# Altium schematic sheet Shift_Regs.SchDoc
size A3
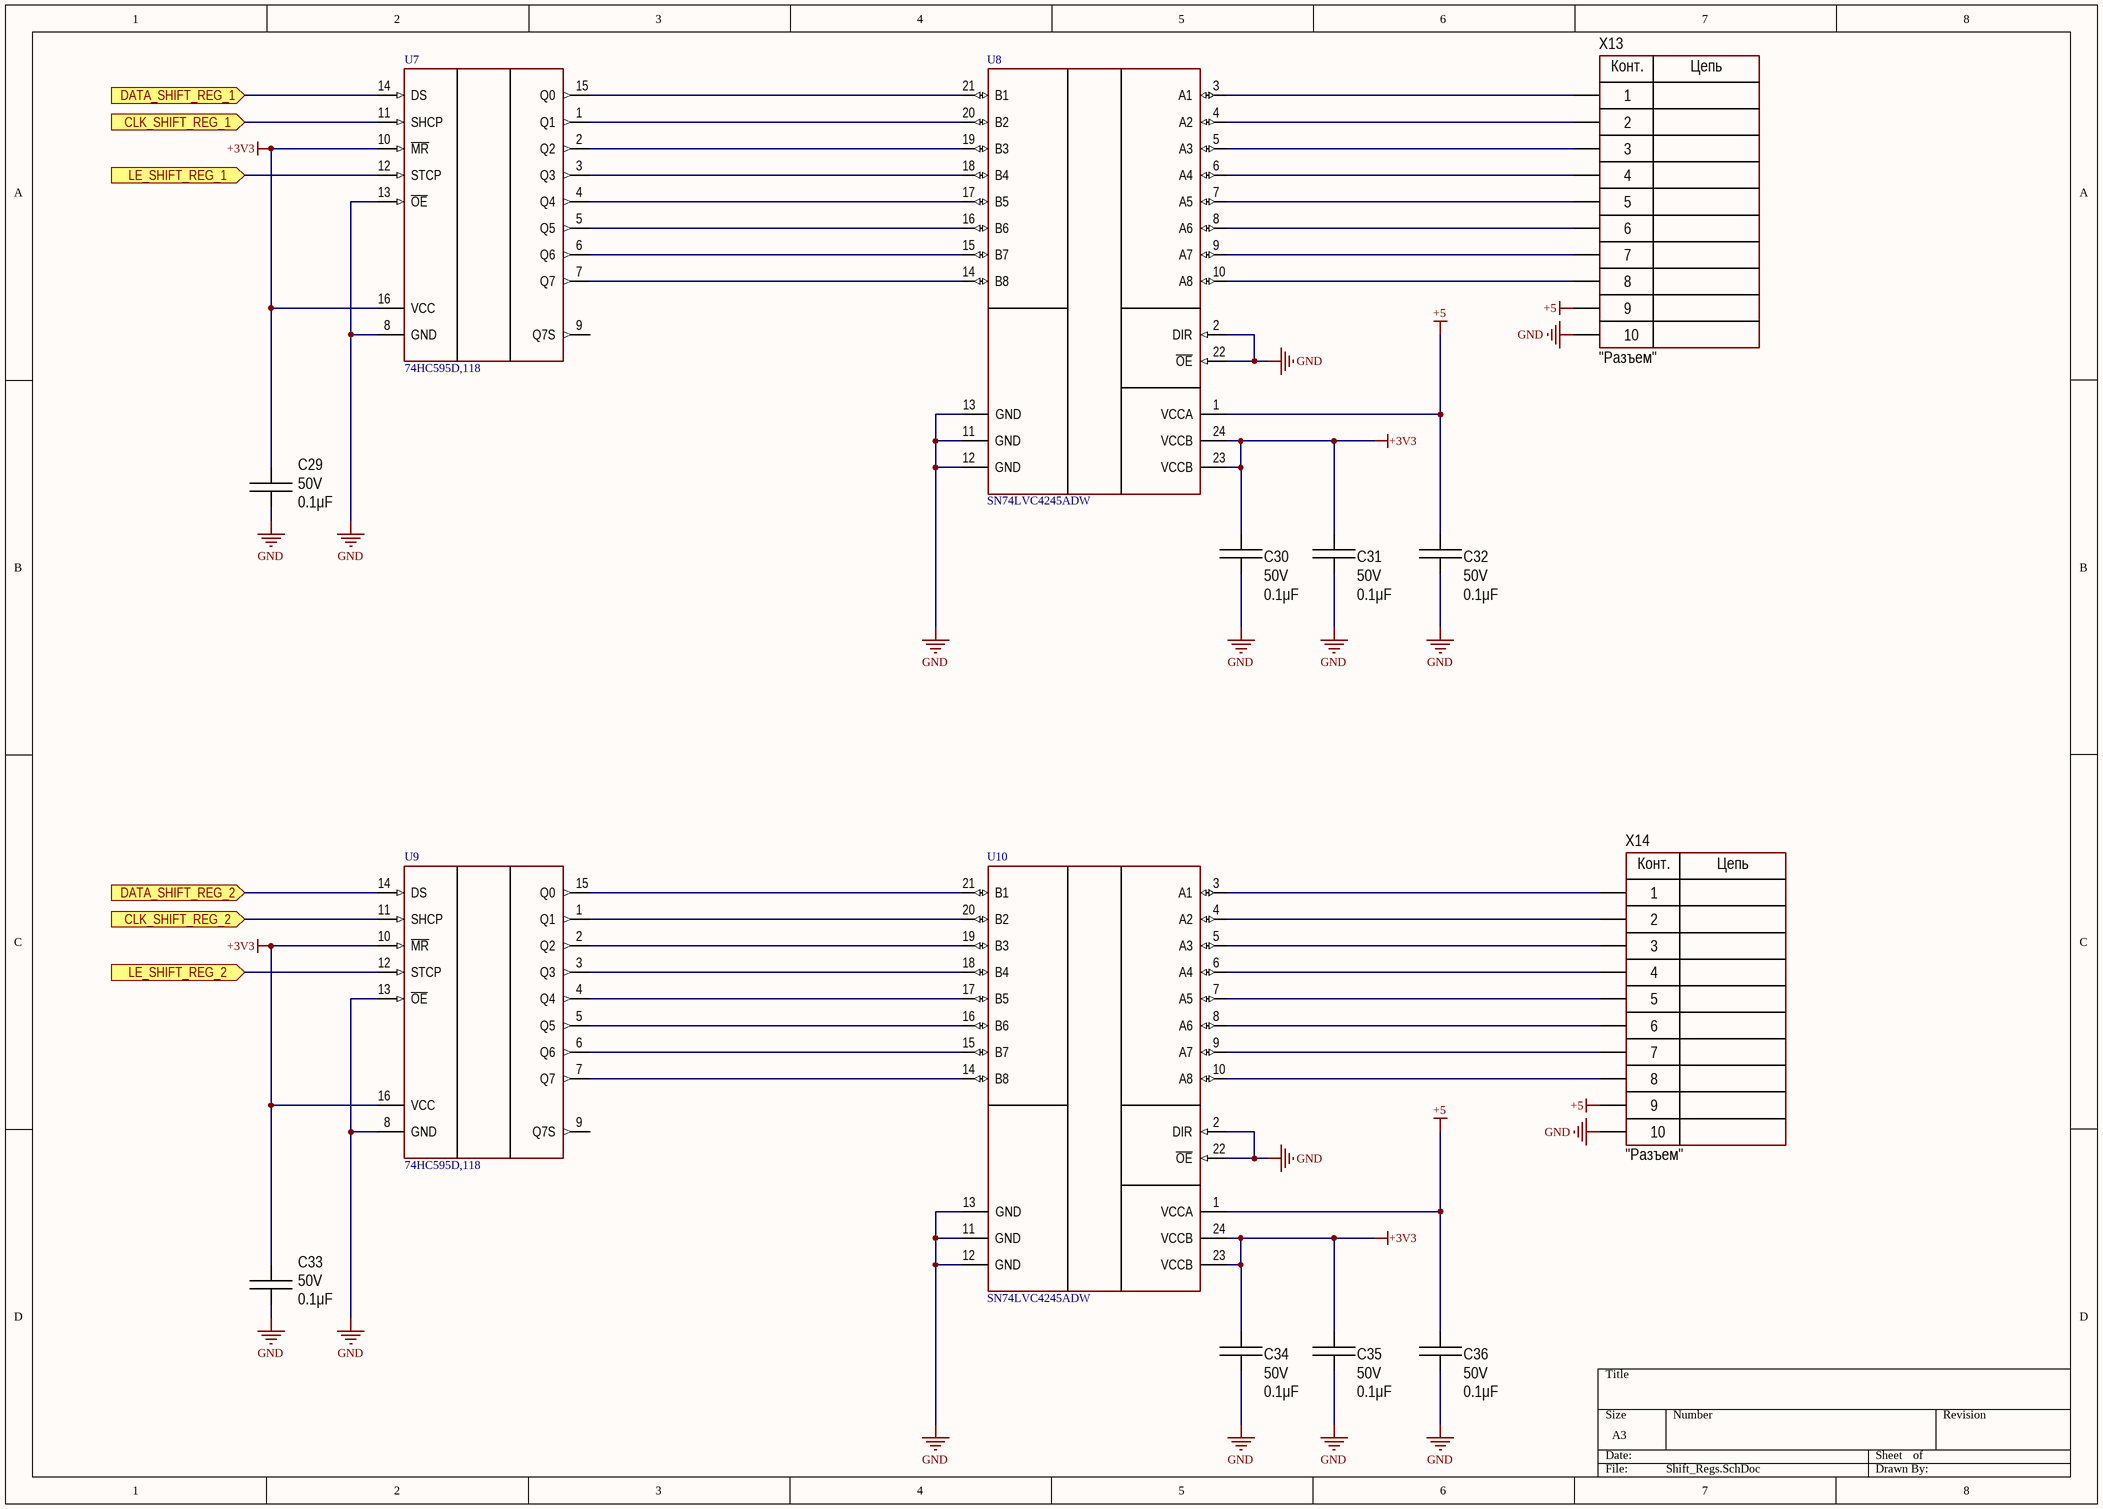
[diagram p0: Shift_Regs.SchDoc]

## Parts
C29  value 0.1μF  Voltage: 50V  [CAP: 1206]
C30  value 0.1μF  Voltage: 50V  [CAP: 1206]
C31  value 0.1μF  Voltage: 50V  [CAP: 1206]
C32  value 0.1μF  Voltage: 50V  [CAP: 1206]
C33  value 0.1μF  Voltage: 50V  [CAP: 1206]
C34  value 0.1μF  Voltage: 50V  [CAP: 1206]
C35  value 0.1μF  Voltage: 50V  [CAP: 1206]
C36  value 0.1μF  Voltage: 50V  [CAP: 1206]
U7  74HC595D,118  [FP-SOT109-1-MFG]
U8  SN74LVC4245ADW  [FP-DW0024A-MFG]
U9  74HC595D,118  [FP-SOT109-1-MFG]
U10  SN74LVC4245ADW  [FP-DW0024A-MFG]
X13  CommentText: "Разъем"  [CON: IDC-10MS]
X14  CommentText: "Разъем"  [CON: IDC-10MS]

## Ports
CLK_SHIFT_REG_1 (in), CLK_SHIFT_REG_2 (in), DATA_SHIFT_REG_1 (in), DATA_SHIFT_REG_2 (in), LE_SHIFT_REG_1 (in), LE_SHIFT_REG_2 (in)

## Nets
+3V3: C29.2 C30.2 C31.2 C33.2 C34.2 C35.2 U7.10(~{MR}) U7.16(VCC) U8.23(VCCB) U8.24(VCCB) U9.10(~{MR}) U9.16(VCC) U10.23(VCCB) U10.24(VCCB)
+5: C32.2 C36.2 U8.1(VCCA) U10.1(VCCA) X13.9 X14.9
GND: C29.1 C30.1 C31.1 C32.1 C33.1 C34.1 C35.1 C36.1 U7.8(GND) U7.13(~{OE}) U8.2(DIR) U8.11(GND) U8.12(GND) U8.13(GND) U8.22(~{OE}) U9.8(GND) U9.13(~{OE}) U10.2(DIR) U10.11(GND) U10.12(GND) U10.13(GND) U10.22(~{OE}) X13.10 X14.10
CLK_SHIFT_REG_1: U7.11(SHCP) ; port CLK_SHIFT_REG_1
CLK_SHIFT_REG_2: U9.11(SHCP) ; port CLK_SHIFT_REG_2
DATA_SHIFT_REG_1: U7.14(DS) ; port DATA_SHIFT_REG_1
DATA_SHIFT_REG_2: U9.14(DS) ; port DATA_SHIFT_REG_2
LE_SHIFT_REG_1: U7.12(STCP) ; port LE_SHIFT_REG_1
LE_SHIFT_REG_2: U9.12(STCP) ; port LE_SHIFT_REG_2
NetU7_1: U7.1(Q1) U8.20(B2)
NetU7_2: U7.2(Q2) U8.19(B3)
NetU7_3: U7.3(Q3) U8.18(B4)
NetU7_4: U7.4(Q4) U8.17(B5)
NetU7_5: U7.5(Q5) U8.16(B6)
NetU7_6: U7.6(Q6) U8.15(B7)
NetU7_7: U7.7(Q7) U8.14(B8)
NetU7_15: U7.15(Q0) U8.21(B1)
NetU8_3: U8.3(A1) X13.1
NetU8_4: U8.4(A2) X13.2
NetU8_5: U8.5(A3) X13.3
NetU8_6: U8.6(A4) X13.4
NetU8_7: U8.7(A5) X13.5
NetU8_8: U8.8(A6) X13.6
NetU8_9: U8.9(A7) X13.7
NetU8_10: U8.10(A8) X13.8
NetU9_1: U9.1(Q1) U10.20(B2)
NetU9_2: U9.2(Q2) U10.19(B3)
NetU9_3: U9.3(Q3) U10.18(B4)
NetU9_4: U9.4(Q4) U10.17(B5)
NetU9_5: U9.5(Q5) U10.16(B6)
NetU9_6: U9.6(Q6) U10.15(B7)
NetU9_7: U9.7(Q7) U10.14(B8)
NetU9_15: U9.15(Q0) U10.21(B1)
NetU10_3: U10.3(A1) X14.1
NetU10_4: U10.4(A2) X14.2
NetU10_5: U10.5(A3) X14.3
NetU10_6: U10.6(A4) X14.4
NetU10_7: U10.7(A5) X14.5
NetU10_8: U10.8(A6) X14.6
NetU10_9: U10.9(A7) X14.7
NetU10_10: U10.10(A8) X14.8

Not connected (* = marked no-connect by the designer): U7 9(Q7S); U9 9(Q7S)

## Notes on the sheet
- (in symbol IDC-10) Конт.; Цепь

## Library data of the parts
C29-C36 = Ceramic_1206: Manufacturer: Yageo; PartNumber: CC1206KRX7R9BB104; ValueManufacturerPartNumber: Ceramic capacitor, 0.1μF, X7R, ±10%, 50V, 1206, -55...+125°C; TypeCapacitor: Ceramic capacitor; Tolerance: ±10%; TypeDielectric: X7R; Package: 1206; HelpURL: https://www.digikey.com/product-detail/en/yageo/CC1206KRX7R9BB104/311-1179-1-ND/303089; Temperature: -55...+125°C
U7 U9 = CMP-14351-000006-1: IC SHIFT REGISTER 8BIT 16SOIC; RoHS Compliant: Yes
U8 U10 = CMP-04899-000091-1: IC TRNSLTR BIDIRECTIONAL 24SOIC; Number of Bits: 8; Low Level Output Current: 24mA; Output Type: Voltage; Propagation Delay: 9.8ns; Min Supply Voltage: 4.5V; Number of Elements: 1; Turn-On Delay Time: 6.7ns; Max Supply Current: 80uA; Max Supply Voltage: 5.5V; Polarity: Non-Inverting; Logic Function: Translator; Operating Supply Voltage: 5V; High Level Output Current: -24mA; Case/Package: SOIC; Height: 2.35mm; Width: 7.52mm; Number of Pins: 24; Weight: 0.022025oz; Lead Free: Lead Free; Packaging: Rail/Tube; Number of Channels: 8; Series: 74LVC; REACH SVHC: No SVHC; RoHS Compliant: Yes; Mount: Surface Mount; Length: 15.4mm; Package Quantity: 25; Radiation Hardening: No; Contact Plating: Gold; Quiescent Current: 80uA; Max Operating Temperature: 85°C; Direction: Bidirectional; Number of Outputs: 8; Technology: CMOS; Min Operating Temperature: -40°C; Number of Circuits: 8
X13 X14 = IDC-10: Manufacturer: Connfly; ValueManufacturerPartNumber: Connector, 10pin, 2.54mm, 250VAC, 3A; TypeConnector: Connector; VoltageMax: 250VAC; Pitch: 2.54mm; CurrentMax: 3A; Multichannel: 10pin; HelpURL: https://www.chipdip.ru/product/idc-10ms; PartNumber: IDC-10